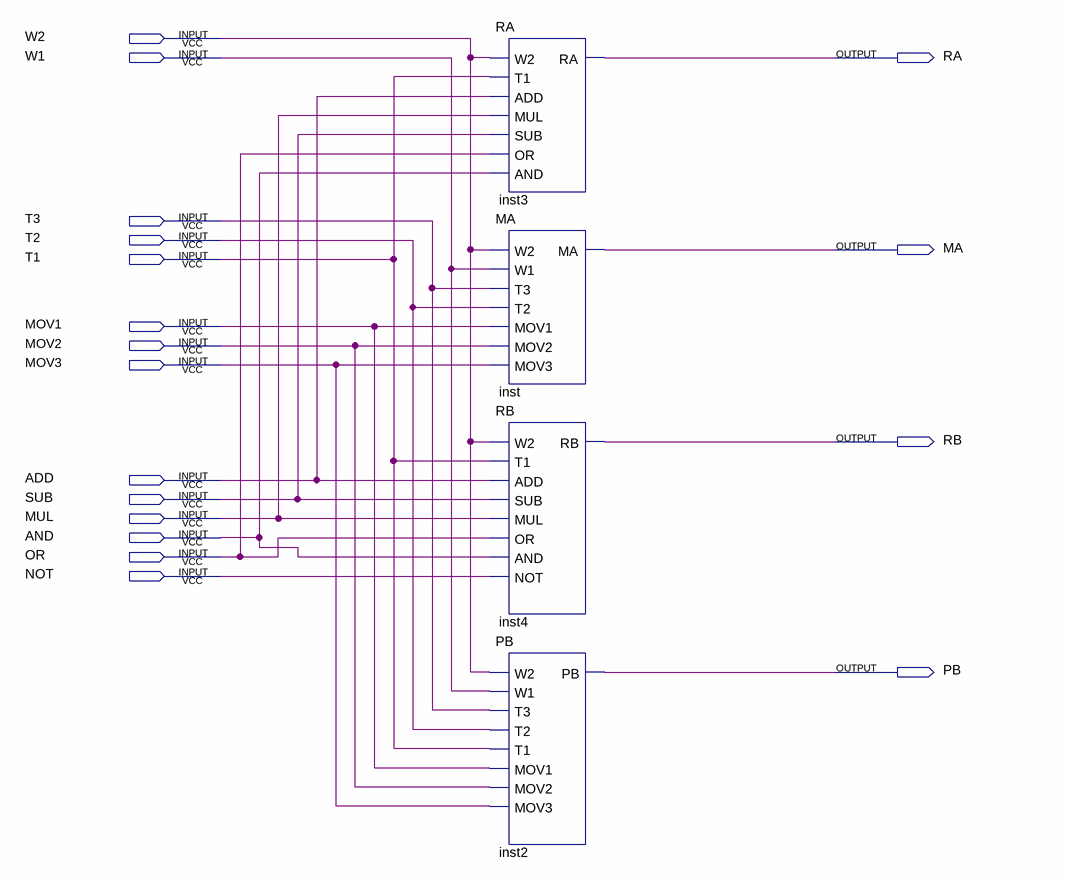
[diagram p0: schematic sheet]
// Quartus schematic RNM.bdf as structural Verilog: 4 symbols, 18 pins
module RNM (
  input  W2,
  input  W1,
  input  T3,
  input  T2,
  input  T1,
  input  MOV1,
  input  MOV2,
  input  MOV3,
  input  ADD,
  input  SUB,
  input  MUL,
  input  AND,
  input  OR,
  input  NOT,
  output RA,
  output MA,
  output RB,
  output PB
);

  RA inst3 (.W2(W2), .T1(T1), .ADD(ADD), .MUL(MUL), .SUB(SUB), .OR(OR), .AND(AND), .RA(RA));
  MA inst (.W2(W2), .W1(W1), .T3(T3), .T2(T2), .MOV1(MOV1), .MOV2(MOV2), .MOV3(MOV3), .MA(MA));
  RB inst4 (.W2(W2), .T1(T1), .ADD(ADD), .SUB(SUB), .MUL(MUL), .OR(OR), .AND(AND), .NOT(NOT), .RB(RB));
  PB inst2 (.W2(W2), .W1(W1), .T3(T3), .T2(T2), .T1(T1), .MOV1(MOV1), .MOV2(MOV2), .MOV3(MOV3), .PB(PB));
endmodule
